# EAGLE design lcd1202 (EAGLE 5.11)
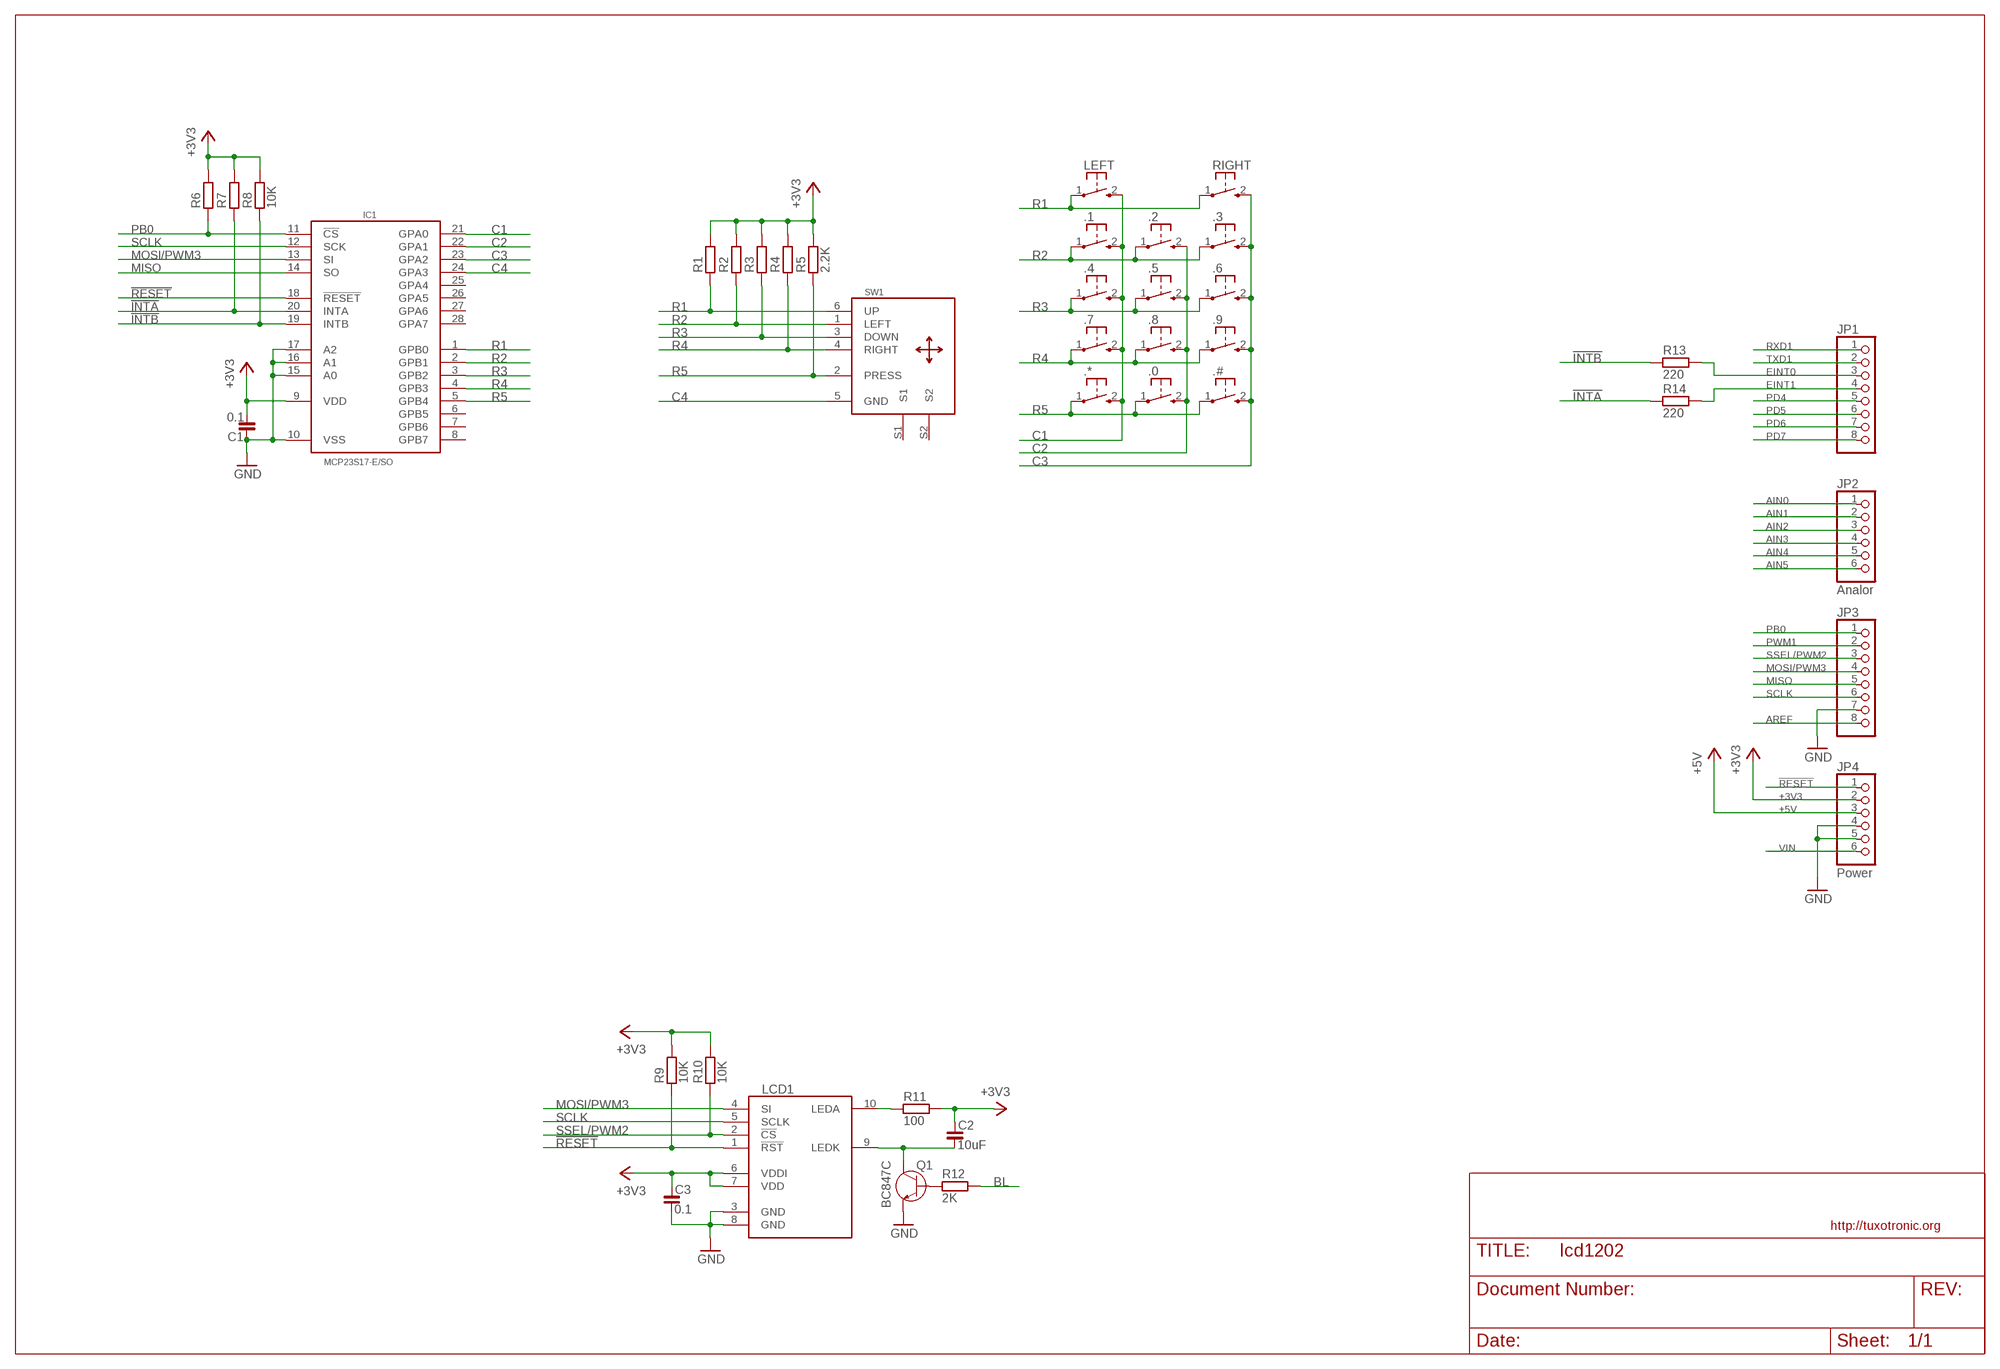
[diagram p0: schematic, sheet 1]

## Parts
.0  KSS-2EG4430  [KSS-2EG4430]
.1  KSS-2EG4430  [KSS-2EG4430]
.2  KSS-2EG4430  [KSS-2EG4430]
.3  KSS-2EG4430  [KSS-2EG4430]
.4  KSS-2EG4430  [KSS-2EG4430]
.5  KSS-2EG4430  [KSS-2EG4430]
.6  KSS-2EG4430  [KSS-2EG4430]
.7  KSS-2EG4430  [KSS-2EG4430]
.8  KSS-2EG4430  [KSS-2EG4430]
.9  KSS-2EG4430  [KSS-2EG4430]
.#  KSS-2EG4430  [KSS-2EG4430]
.*  KSS-2EG4430  [KSS-2EG4430]
C1  0.1  C_0603  [C0603]
C2  10uF  C_0805  [C0805]
C3  0.1  C_0603  [C0603]
IC1  MCP23S17-E/SO  [SO28W]
JP1  PINHD-1X8_2.54  [1X08]
JP2  Analor  PINHD-1X6_2.54  [1X06]
JP3  PINHD-1X8_2.54  [1X08]
JP4  Power  PINHD-1X6_2.54  [1X06]
LCD1  LCD1202  [NOKIA1202LCD]
LEFT  KSS-2EG4430  [KSS-2EG4430]
Q1  BC847C  [SOT23]
R1  2.2K  R_0603  [R0603]
R2  2.2K  R_0603  [R0603]
R3  2.2K  R_0603  [R0603]
R4  2.2K  R_0603  [R0603]
R5  2.2K  R_0603  [R0603]
R6  10K  R_0603  [R0603]
R7  10K  R_0603  [R0603]
R8  10K  R_0603  [R0603]
R9  10K  R_0603  [R0603]
R10  10K  R_0603  [R0603]
R11  100  R_0603  [R0603]
R12  2K  R_0603  [R0603]
R13  220  R_0603  [R0603]
R14  220  R_0603  [R0603]
RIGHT  KSS-2EG4430  [KSS-2EG4430]
SW1  NOKIA-JOY  [NOKIA_JOY]

## Nets
!INTA: IC1.20(INTA) R7.1 R14.1
!INTB: IC1.19(INTB) R8.1 R13.1
!RESET: IC1.18(!RESET) JP4.1 LCD1.1(!RST) R9.1
+3V3: C1.2 C2.1 C3.1 IC1.9(VDD) JP4.2 LCD1.6(VDDI) LCD1.7(VDD) R1.2 R2.2 R3.2 R4.2 R5.2 R6.2 R7.2 R8.2 R9.2 R10.2 R11.2
+5V: JP4.3
AIN0: JP2.1
AIN1: JP2.2
AIN2: JP2.3
AIN3: JP2.4
AIN4: JP2.5
AIN5: JP2.6
AREF: JP3.8
BL: R12.2
C1: .1.2(S) .4.2(S) .7.2(S) .*.2(S) IC1.21(GPA0) LEFT.2(S)
C2: .0.2(S) .2.2(S) .5.2(S) .8.2(S) IC1.22(GPA1)
C3: .3.2(S) .6.2(S) .9.2(S) .#.2(S) IC1.23(GPA2) RIGHT.2(S)
C4: IC1.24(GPA3) SW1.5(GND)
EINT0: JP1.3 R13.2
EINT1: JP1.4 R14.2
GND: C1.1 C3.2 IC1.10(VSS) IC1.15(A0) IC1.16(A1) IC1.17(A2) JP3.7 JP4.4 JP4.5 LCD1.3(GND) LCD1.8(GND) Q1.2(E)
MISO: IC1.14(SO) JP3.5
MOSI/PWM3: IC1.13(SI) JP3.4 LCD1.4(SI)
N$7: C2.2 LCD1.9(LEDK) Q1.3(C)
N$8: LCD1.10(LEDA) R11.1
N$9: Q1.1(B) R12.1
PB0: IC1.11(!CS) JP3.1 R6.1
PD4: JP1.5
PD5: JP1.6
PD6: JP1.7
PD7: JP1.8
PWM1: JP3.2
R1: IC1.1(GPB0) LEFT.1(P) R1.1 RIGHT.1(P) SW1.6(UP)
R2: .1.1(P) .2.1(P) .3.1(P) IC1.2(GPB1) R2.1 SW1.1(LEFT)
R3: .4.1(P) .5.1(P) .6.1(P) IC1.3(GPB2) R3.1 SW1.3(DOWN)
R4: .7.1(P) .8.1(P) .9.1(P) IC1.4(GPB3) R4.1 SW1.4(RIGHT)
R5: .0.1(P) .#.1(P) .*.1(P) IC1.5(GPB4) R5.1 SW1.2(PRESS)
RXD1: JP1.1
SCLK: IC1.12(SCK) JP3.6 LCD1.5(SCLK)
SSEL/PWM2: JP3.3 LCD1.2(!CS) R10.1
TXD1: JP1.2
VIN: JP4.6
Unconnected: IC1.6(GPB5) IC1.7(GPB6) IC1.8(GPB7) IC1.25(GPA4) IC1.26(GPA5) IC1.27(GPA6) IC1.28(GPA7) SW1.S1 SW1.S2

## Library data of the parts
.0 .1-.9 .# .* LEFT RIGHT = buttons:KSS-2EG4430: Size: 3x6mm Height: 5mm from PCB Rating: DC12v 50mA Travel: 0.25±0.10mm Operating Force: 180±50gf Return Force: 60gf min Contact resistance: 100m? max Insulation resistance: 100M? min Operating life?50,000 cycles
C1-C3 = rc-master-smd:C_: NON-POLARIZED CAP
IC1 = some:MCP23S17-E: 16-Bit I/O Expander with Serial Interface
JP1 JP3 = pinhead-fixdrills:PINHD-1X8: PIN HEADER
JP2 JP4 = pinhead-fixdrills:PINHD-1X6: PIN HEADER
LCD1 = lcd1202:LCD1202: 1.3" b/w graphics display 96x68 pixel. From Nokia 1202 cell phone
Q1 = semiconductor:BC847: Bipolar transistor NPN-structure
R1-R14 = rc-master-smd:R_: RESISTOR
SW1 = buttons:NOKIA-JOY: Nokia 3250/6820/N73 Joystick

## Board
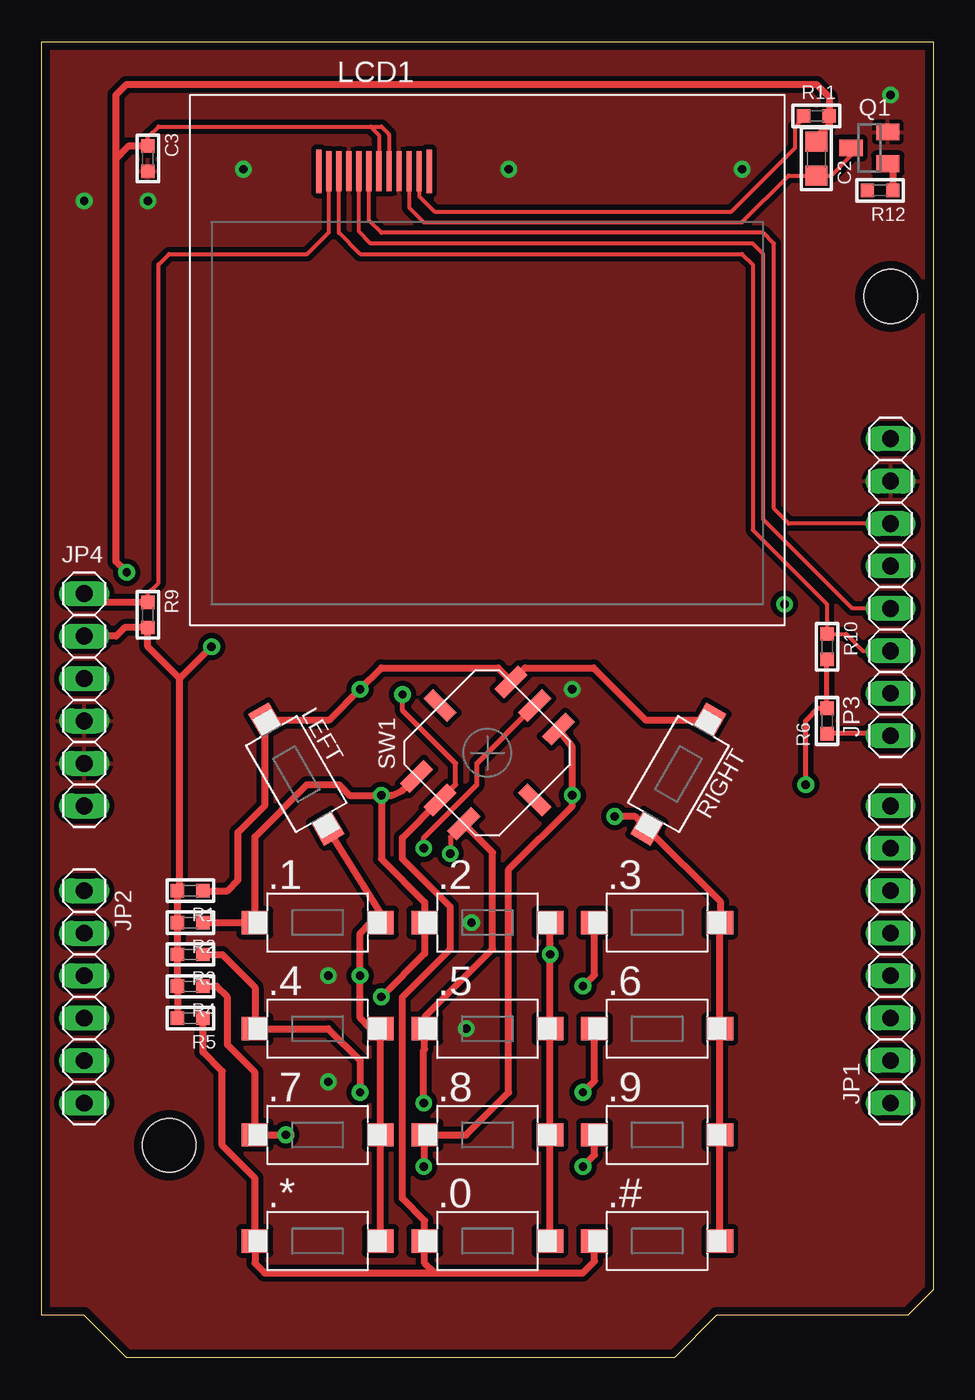
[diagram p1: board, top side]
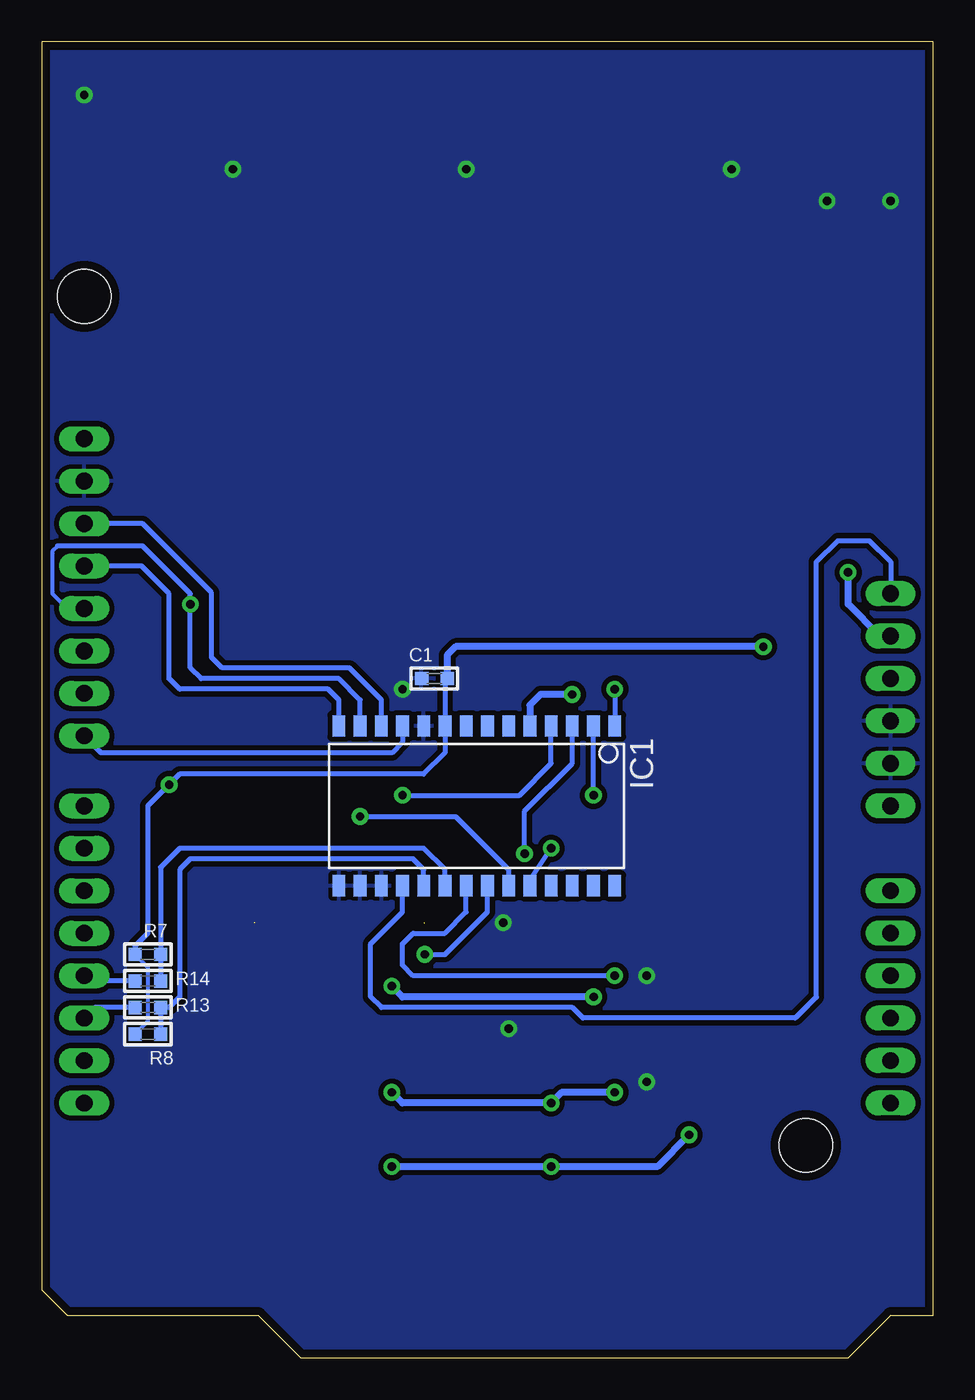
[diagram p2: board, bottom side, seen from below]

Size 53.34 x 78.74 mm. Coordinates in mm from the lower left corner, seen from the top.
Outline: 53.34,78.74 53.34,4.06 51.82,2.54 40.39,2.54 37.85,0 5.08,0 2.54,2.54 0,2.54 0,78.74 53.34,78.74
Copper layers (1*16): Top 0.018mm / dielectric 1.5011mm / Bottom 0.018mm
Design rules "resonit-speed-18um": minimum track width 0.15mm, minimum drill 0.4mm, track to track 0.15mm, track to pad 0.15mm, pad to pad 0.15mm, via to via 0.15mm, smd to smd 0.15mm, copper to edge 0.5mm, drill to drill 8mil, minimum pad ring 0.25mm, minimum via ring 0.25mm, stop-mask expansion 4mil, vias tented up to drill 0.6mm, thermal gap 10mil
Holes 3.2 mm at 7.62,12.7 50.8,63.5

### Footprints (pad centres in the part's own frame; a part is rotated, then mirrored left to right if it is on the bottom)
KSS-2EG4430 = smd 1.6 x 1.4: 1 -3.75,0; 2 3.75,0
C0603 = smd 0.8 x 0.8: 1 -0.762,0; 2 0.762,0
C0805 = smd 1.2 x 1.3: 1 -1.016,0; 2 1.016,0
SO28W = smd 0.762 x 1.27: 1 -7.62,-4.78; 2 -6.35,-4.78; 3 -5.08,-4.78; 4 -3.81,-4.78; 5 -2.54,-4.78; 6 -1.27,-4.78; 7 0,-4.78; 8 1.27,-4.78; 9 2.54,-4.78; 10 3.81,-4.78; 11 5.08,-4.78; 12 6.35,-4.78; 13 7.62,-4.78; 14 8.89,-4.78; 15 8.89,4.78; 16 7.62,4.78; 17 6.35,4.78; 18 5.08,4.78; 19 3.81,4.78; 20 2.54,4.78; 21 1.27,4.78; 22 0,4.78; 23 -1.27,4.78; 24 -2.54,4.78; 25 -3.81,4.78; 26 -5.08,4.78; 27 -6.35,4.78; 28 -7.62,4.78
1X08 = drill 1 long: 1 -8.89,0; 2 -6.35,0; 3 -3.81,0; 4 -1.27,0; 5 1.27,0; 6 3.81,0; 7 6.35,0; 8 8.89,0
1X06 = drill 1 long: 1 -6.35,0; 2 -3.81,0; 3 -1.27,0; 4 1.27,0; 5 3.81,0; 6 6.35,0
NOKIA1202LCD = smd 0.32 x 2.6: 0 -10.09,14.478; 11 -3.49,14.478 | smd 0.32 x 2.4: 1 -9.49,14.478; 2 -8.89,14.478; 3 -8.29,14.478; 4 -7.69,14.478; 5 -7.09,14.478; 6 -6.49,14.478; 7 -5.89,14.478; 8 -5.29,14.478; 9 -4.69,14.478; 10 -4.09,14.478
SOT23 = smd 1 x 1.4: 1 -0.95,-1.1; 2 0.95,-1.1; 3 0,1.1
R0603 = smd 0.8 x 0.8: 1 -0.762,0; 2 0.762,0
NOKIA_JOY = smd 2 x 0.8 rotated 45: 1 -4.243,-1.414; 2 -2.828,-2.828; 3 -1.414,-4.243; 4 4.243,1.414; 5 2.828,2.828; 6 1.414,4.243 | smd 2 x 0.8 rotated 135: S1 -2.828,2.828; S2 2.828,-2.828

### Placement (x,y rotation side)
.0  26.67,6.99 0 top
.1  16.51,26.04 0 top
.2  26.67,26.04 0 top
.3  36.83,26.04 0 top
.4  16.51,19.68 0 top
.5  26.67,19.68 0 top
.6  36.83,19.68 0 top
.7  16.51,13.34 0 top
.8  26.67,13.34 0 top
.9  36.83,13.34 0 top
.#  36.83,6.99 0 top
.*  16.51,6.99 0 top
C1  29.84,40.64 0 bottom
C2  46.35,71.75 270 top
C3  6.35,71.75 270 top
IC1  26.67,33.02 180 bottom
JP1  50.8,24.13 90 top
JP2  2.54,21.59 270 top
JP3  50.8,46.1 90 top
JP4  2.54,39.37 270 top
LCD1  26.67,56.52 0 top
LEFT  15.24,34.92 300 top
Q1  49.53,72.39 90 top
R1  8.89,27.94 180 top
R2  8.89,26.04 180 top
R3  8.89,24.13 180 top
R4  8.89,22.23 180 top
R5  8.89,20.32 180 top
R6  46.99,38.1 90 top
R7  46.99,24.13 180 bottom
R8  46.99,19.37 180 bottom
R9  6.35,44.45 270 top
R10  46.99,42.55 270 top
R11  46.35,74.3 0 top
R12  50.16,69.85 180 top
R13  46.99,20.95 180 bottom
R14  46.99,22.54 180 bottom
RIGHT  38.1,34.92 240 top
SW1  26.67,36.2 0 top

### Tracks (layer width: path | path; a pad name or v marks a point on that pad's centre or on a via)
!INTA
  Bottom 0.305: IC1.20 29.21,29.21 30.48,30.48 45.09,30.48 46.23,29.34 R7.1 R14.1
!INTB
  Bottom 0.305: IC1.19 30.48,29.21 31.11,29.84 44.45,29.84 45.09,29.21 45.09,21.59 45.72,20.95 R13.1 R8.1
!RESET
  Top 0.254: LCD1.1 17.18,67.34 15.88,66.04 7.62,66.04 6.99,65.41 6.99,46.35 6.35,45.72 R9.1
  Top 0.406: R9.1 3.05,45.21 JP4.1
  Bottom 0.305: IC1.18 31.75,26.67 33.66,24.77 33.66,21.59 33.02,20.95 21.59,20.95 20.95,20.32 8.26,20.32 6.99,21.59 6.99,47.62 5.71,48.9 3.81,48.9 2.54,47.62 JP4.1
+3V3  (via drill 0.5)
  Top 0.254: LCD1.6 20.18,73.17 19.68,73.66 | LCD1.7 20.78,73.2 20.32,73.66 19.68,73.66 | 19.68,73.66 6.99,73.66 6.35,73.03 C3.1
  Top 0.305: R10.2 R6.2 46.48,38.86 45.72,38.1 v45.72,34.29
  Top 0.406: R5.2 R4.2 R3.2 R2.2 R1.2 8.26,28.07 8.26,40.64 | JP4.2 4.45,43.18 4.95,43.69 R9.2 6.35,42.55 8.26,40.64 | C3.1 5.21,72.52 4.45,71.75 | 4.45,71.75 4.45,47.62 v5.08,46.99 | 4.45,71.75 4.45,75.56 5.08,76.2 46.35,76.2 47.12,75.44 R11.2 47.12,73.79 46.35,73.03 C2.1 | 8.26,40.64 v10.16,42.55
  Bottom 0.254: R7.2 46.99,23.37 46.99,20.13 R8.2
  Bottom 0.305: C1.2 29.21,40.51 IC1.9 29.21,36.2 30.48,34.92 45.09,34.92 v45.72,34.29 46.99,33.02 46.99,25.4 47.75,24.64 R7.2
  Bottom 0.406: v5.08,46.99 5.08,45.09 3.17,43.18 JP4.2 | v10.16,42.55 28.57,42.55 29.08,42.04 C1.2
C1  (via drill 0.5)
  Top 0.406: .*.2 .7.2 .4.2 19.68,19.68 19.05,20.32 v19.05,22.86 19.05,25.4 19.68,26.04 .1.2 20.26,26.63 LEFT.2
  Bottom 0.305: IC1.21 27.94,26.67 29.21,25.4 31.11,25.4 31.75,24.77 31.75,23.5 31.11,22.86 v19.05,22.86
C2  (via drill 0.5)  (1 unrouted)
  Top 0.406: .0.2 .8.2 .5.2 v30.42,24.13 30.42,24.77 30.42,25.98 30.48,26.04
  Bottom 0.305: IC1.22 26.67,26.67 29.21,24.13 v30.42,24.13
C3  (via drill 0.5)  (1 unrouted)
  Top 0.406: .#.2 .9.2 .6.2 40.58,25.98 40.64,26.04 40.64,27.26 RIGHT.2 35.52,32.38 v34.29,32.38
  Bottom 0.305: IC1.23 25.4,29.21 28.57,32.38 v34.29,32.38
C4  (via drill 0.5)
  Top 0.305: v22.86,30.48 22.86,31.11 26.04,34.29 26.04,35.56 SW1.5
  Bottom 0.305: IC1.24 24.13,28.57 v22.86,30.48
EINT0
  Bottom 0.305: R13.2 50.16,20.95 JP1.3
EINT1
  Bottom 0.305: R14.2 50.48,22.54 JP1.4
GND  (via drill 0.5)
  other vias: 17.14,16.51 17.14,22.86 25.72,26.04 25.4,19.68 31.75,40.01 12.06,71.12 27.94,71.12 6.35,69.22 2.54,69.22 41.91,71.12 50.8,75.56
  pour Top (isolate 0.305): -0.64,79.38 53.98,79.38 53.98,-0.64 -0.64,-0.64
  pour Bottom (isolate 0.305): -0.64,79.38 53.98,79.38 53.98,-0.64 -0.64,-0.64
MISO
  Bottom 0.305: IC1.14 35.56,39.37 36.2,40.01 45.09,40.01 45.72,40.64 45.72,45.72 47.37,47.37 JP3.5
MOSI/PWM3  (via drill 0.5)
  Top 0.254: LCD1.4 18.98,67.38 19.68,66.67 42.55,66.67 43.18,66.04 43.18,50.16 48.51,44.83 JP3.4
  Bottom 0.254: 52.39,48.58 52.7,48.26 52.7,45.72 51.82,44.83
  Bottom 0.305: IC1.13 34.29,39.37 35.56,40.64 43.81,40.64 44.45,41.27 v44.45,45.09 44.45,45.72 47.31,48.58 52.39,48.58 | 51.82,44.83 JP3.4
N$7
  Top 0.254: Q1.3 48.43,71.92 47.24,70.74 C2.2 44.7,70.74 41.91,67.94 22.86,67.94 21.98,68.83 LCD1.9
N$8
  Top 0.254: R11.1 45.59,74.17 45.09,73.66 45.09,72.39 41.27,68.58 23.5,68.58 22.58,69.5 LCD1.10
N$9
  Top 0.406: R12.1 50.93,71.14 Q1.1
PB0
  Top 0.305: R6.1 50.67,37.34 JP3.1
  Bottom 0.305: IC1.11 31.75,36.83 32.38,36.2 49.78,36.2 JP3.1
R1  (via drill 0.5)
  Top 0.406: RIGHT.1 36.12,38.17 33.02,41.27 28.92,41.27 SW1.6 28.08,40.5 27.3,41.27 20.32,41.27 v19.05,40.01 17.22,38.17 LEFT.1 13.37,33.05 11.75,31.43 11.75,28.57 11.11,27.94 R1.1
  Bottom 0.305: v19.05,40.01 IC1.1
R2  (via drill 0.5)
  Top 0.406: SW1.1 21.59,33.94 20.95,33.66 v20.32,33.66 | v20.32,33.66 20.32,29.84 22.92,27.25 .2.1 22.92,24.19 v20.32,21.59 | R2.1 .1.1 12.76,31.18 15.88,34.29 17.78,34.29 18.41,33.66 v20.32,33.66 | .3.1 33.08,22.92 v32.38,22.23
  Bottom 0.305: v20.32,33.66 IC1.2
  Bottom 0.406: v20.32,21.59 31.75,21.59 v32.38,22.23
R3  (via drill 0.5)
  Top 0.305: v24.45,30.16 24.45,31.14 SW1.3
  Top 0.406: R3.1 10.79,24.13 12.76,22.16 .4.1 17.14,19.68 19.05,17.78 v19.05,15.88 | .6.1 33.08,16.57 v32.38,15.88 | v22.86,15.24 22.86,18.41 22.92,18.48 .5.1 22.92,20.38 26.99,24.45 26.99,30.22 SW1.3
  Bottom 0.305: IC1.3 21.59,35.56 24.45,32.7 v24.45,30.16
  Bottom 0.406: v32.38,15.88 31.75,15.24 v22.86,15.24 22.23,15.88 v19.05,15.88
R4  (via drill 0.5)
  Top 0.406: SW1.4 31.75,36.54 v31.75,33.66 31.75,33.02 27.94,29.21 27.94,15.88 25.4,13.34 .8.1 22.92,11.49 v22.86,11.43 | R4.1 10.48,22.23 11.11,21.59 11.11,18.73 12.76,17.09 .7.1 v14.61,13.34 | .9.1 33.08,12.12 v32.38,11.43
  Bottom 0.305: IC1.4 22.86,35.56 24.77,33.66 v31.75,33.66
  Bottom 0.406: v32.38,11.43 v22.86,11.43 16.51,11.43 v14.61,13.34
R5  (via drill 0.5)
  Top 0.305: SW1.2 24.77,34.29 24.77,35.56 21.59,38.73 v21.59,39.69
  Top 0.406: SW1.2 21.59,31.11 21.59,29.84 24.45,26.99 24.45,24.45 21.59,21.59 21.59,9.53 22.92,8.2 .0.1 22.92,5.66 23.5,5.08 | .#.1 33.08,5.78 32.38,5.08 23.5,5.08 | 23.5,5.08 13.34,5.08 12.76,5.66 .*.1 12.76,10.73 10.79,12.7 10.79,17.14 9.65,18.29 R5.1
  Bottom 0.406: IC1.5 24.13,39.05 23.5,39.69 v21.59,39.69
SCLK
  Top 0.254: LCD1.5 19.58,68.05 20.32,67.31 43.18,67.31 43.81,66.67 43.81,50.8 44.7,49.91 JP3.6
  Bottom 0.305: IC1.12 33.02,39.37 34.92,41.27 42.55,41.27 43.18,41.91 43.18,45.78 47.31,49.91 JP3.6
SSEL/PWM2
  Top 0.254: LCD1.2 17.78,67.31 19.05,66.04 41.91,66.04 42.55,65.41 42.55,49.53 46.99,45.09 R10.1 48.13,43.31 49.15,42.29 JP3.3